# EAGLE design M220loads (EAGLE 6.6.0)
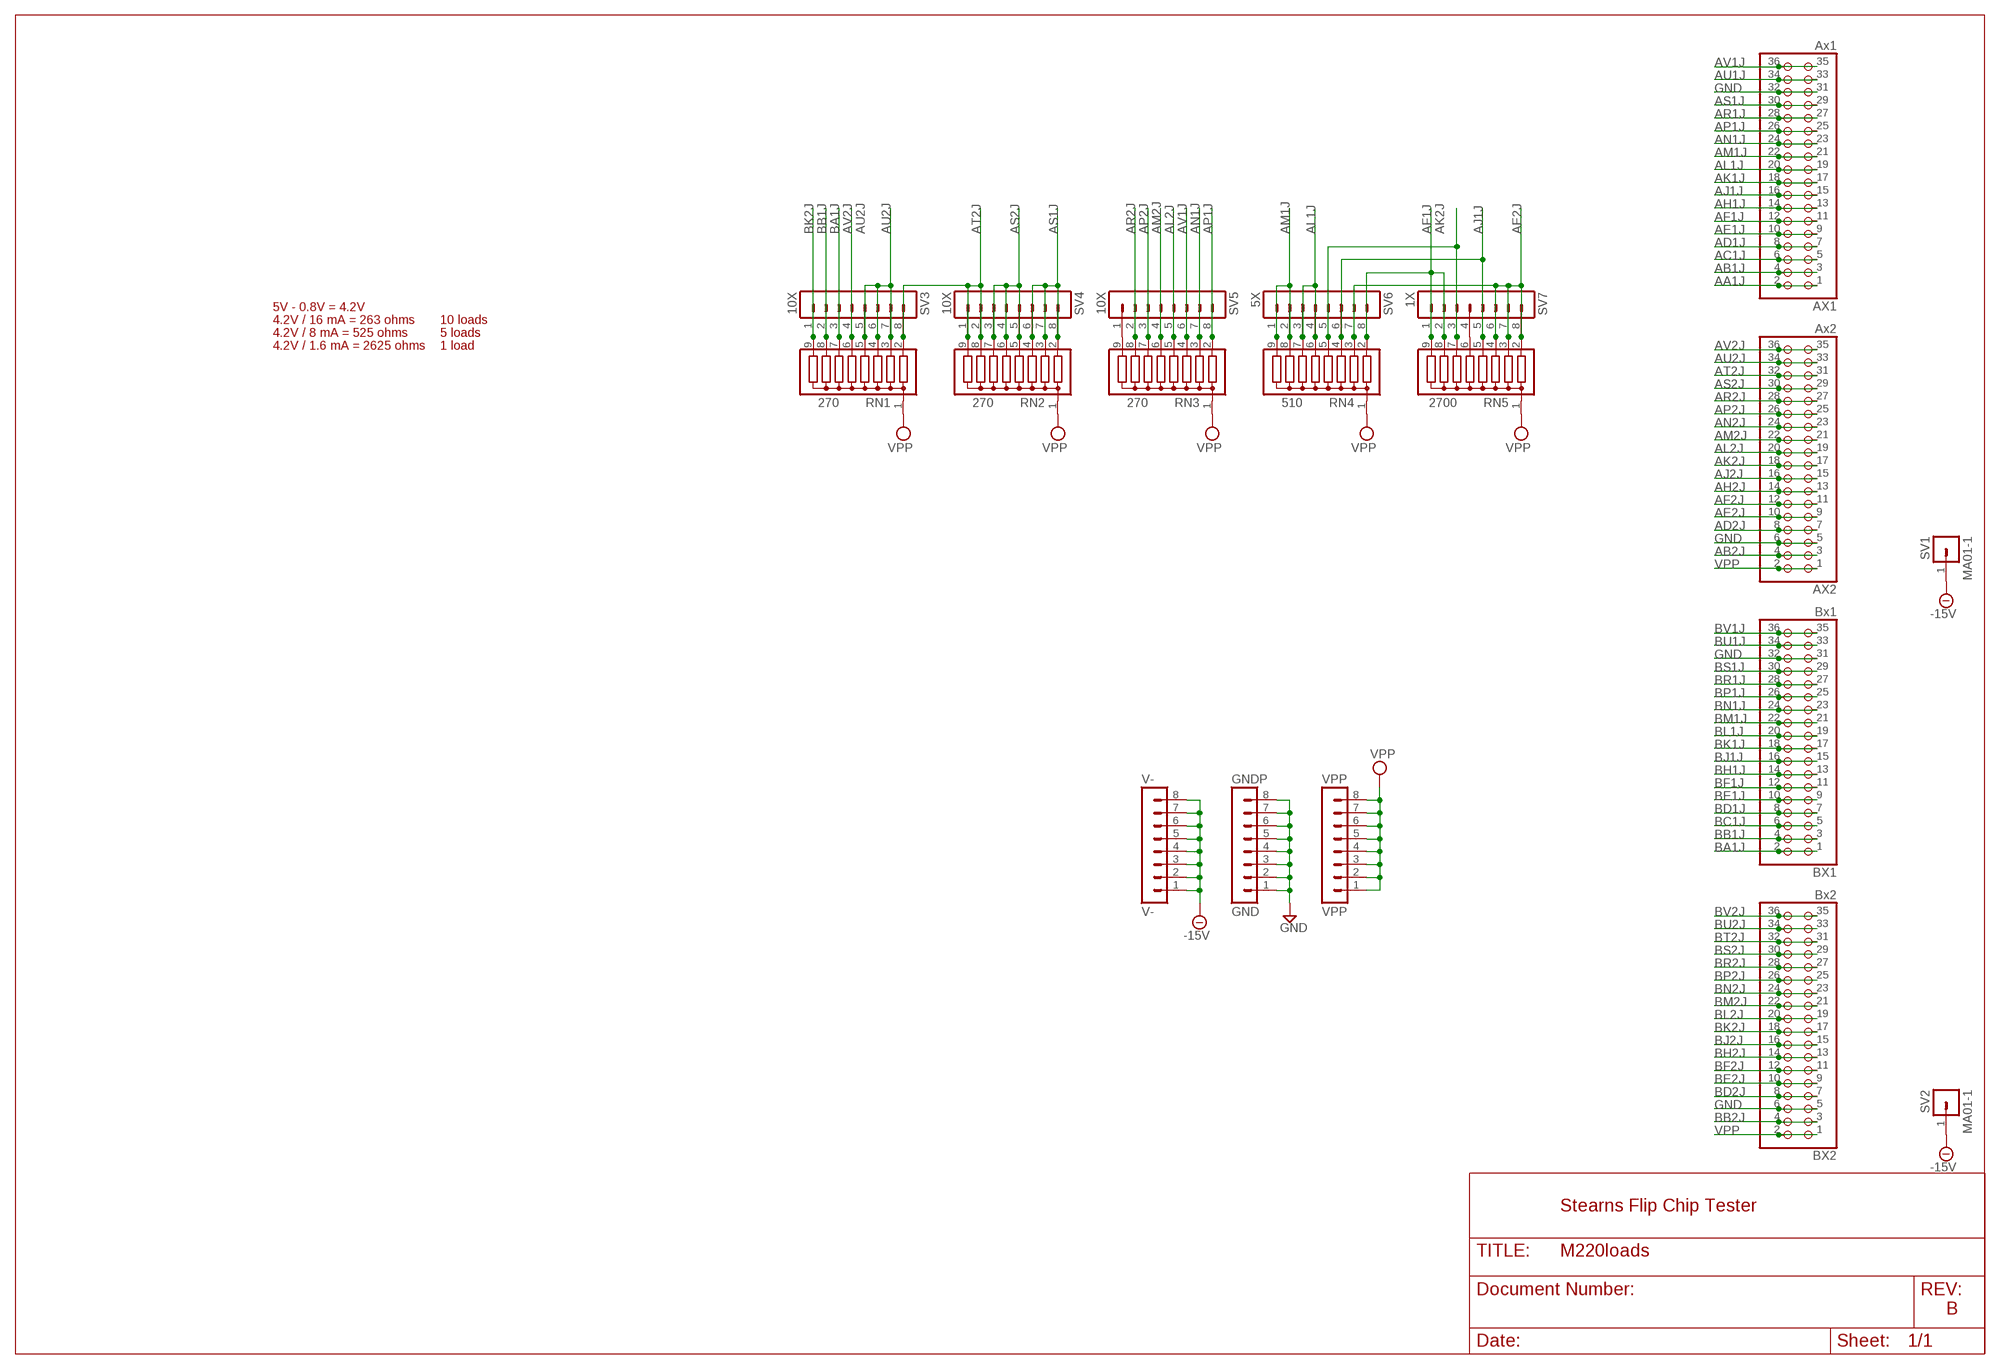
[diagram p0: schematic, sheet 1]

## Parts
AX1  Ax1  PINHD-2X18  [2X18]
AX2  Ax2  PINHD-2X18  [2X18]
BX1  Bx1  PINHD-2X18  [2X18]
BX2  Bx2  PINHD-2X18  [2X18]
GNDP  GND  MA08-1  [MA08-1]
RN1  270  G08R  [SIL9]
RN2  270  G08R  [SIL9]
RN3  270  G08R  [SIL9]
RN4  510  G08R  [SIL9]
RN5  2700  G08R  [SIL9]
SV1  MA01-1  [MA01-1]
SV2  MA01-1  [MA01-1]
SV3  10X  MA08-1  [MA08-1]
SV4  10X  MA08-1  [MA08-1]
SV5  10X  MA08-1  [MA08-1]
SV6  5X  MA08-1  [MA08-1]
SV7  1X  MA08-1  [MA08-1]
V-  V-  MA08-1  [MA08-1]
VPP  VPP  MA08-1  [MA08-1]

## Nets
-15V [Supply]: SV1.1 SV2.1 V-.1 V-.2 V-.3 V-.4 V-.5 V-.6 V-.7 V-.8
AA1J: AX1.1 AX1.2
AB1J: AX1.3 AX1.4
AB2J [Supply]: AX2.3 AX2.4
AC1J: AX1.5 AX1.6
AD1J: AX1.7 AX1.8
AD2J: AX2.7 AX2.8
AE1J: AX1.9 AX1.10
AE2J: AX2.9 AX2.10 RN4.3 RN5.2 RN5.3 RN5.4 SV6.7 SV7.6 SV7.7 SV7.8
AF1J: AX1.11 AX1.12 RN4.2 RN5.8 RN5.9 SV6.8 SV7.1 SV7.2
AF2J: AX2.11 AX2.12
AH1J: AX1.13 AX1.14
AH2J: AX2.13 AX2.14
AJ1J: AX1.15 AX1.16 RN4.4 RN5.5 SV6.6 SV7.5
AJ2J: AX2.15 AX2.16
AK1J: AX1.17 AX1.18
AK2J: AX2.17 AX2.18 RN4.5 RN5.7 SV6.5 SV7.3
AL1J: AX1.19 AX1.20 RN4.6 RN4.7 SV6.3 SV6.4
AL2J: AX2.19 AX2.20 RN3.5 SV5.5
AM1J: AX1.21 AX1.22 RN4.8 RN4.9 SV6.1 SV6.2
AM2J: AX2.21 AX2.22 RN3.6 SV5.4
AN1J: AX1.23 AX1.24 RN3.3 SV5.7
AN2J: AX2.23 AX2.24
AP1J: AX1.25 AX1.26 RN3.2 SV5.8
AP2J: AX2.25 AX2.26 RN3.7 SV5.3
AR1J: AX1.27 AX1.28
AR2J: AX2.27 AX2.28 RN3.8 SV5.2
AS1J: AX1.29 AX1.30 RN2.2 RN2.3 RN2.4 SV4.6 SV4.7 SV4.8
AS2J: AX2.29 AX2.30 RN2.5 RN2.6 RN2.7 SV4.3 SV4.4 SV4.5
AT2J: AX2.31 AX2.32 RN1.2 RN2.8 RN2.9 SV3.8 SV4.1 SV4.2
AU1J: AX1.33 AX1.34
AU2J: AX2.33 AX2.34 RN1.3 RN1.4 RN1.5 SV3.5 SV3.6 SV3.7
AV1J: AX1.35 AX1.36 RN3.4 SV5.6
AV2J: AX2.35 AX2.36 RN1.6 SV3.4
BA1J: BX1.1 BX1.2 RN1.7 SV3.3
BB1J: BX1.3 BX1.4 RN1.8 SV3.2
BB2J: BX2.3 BX2.4
BC1J: BX1.5 BX1.6
BD1J: BX1.7 BX1.8
BD2J: BX2.7 BX2.8
BE1J: BX1.9 BX1.10
BE2J: BX2.9 BX2.10
BF1J: BX1.11 BX1.12
BF2J: BX2.11 BX2.12
BH1J: BX1.13 BX1.14
BH2J: BX2.13 BX2.14
BJ1J: BX1.15 BX1.16
BJ2J: BX2.15 BX2.16
BK1J: BX1.17 BX1.18
BK2J: BX2.17 BX2.18 RN1.9 SV3.1
BL1J: BX1.19 BX1.20
BL2J: BX2.19 BX2.20
BM1J: BX1.21 BX1.22
BM2J: BX2.21 BX2.22
BN1J: BX1.23 BX1.24
BN2J: BX2.23 BX2.24
BP1J: BX1.25 BX1.26
BP2J: BX2.25 BX2.26
BR1J: BX1.27 BX1.28
BR2J: BX2.27 BX2.28
BS1J: BX1.29 BX1.30
BS2J: BX2.29 BX2.30
BT2J: BX2.31 BX2.32
BU1J: BX1.33 BX1.34
BU2J: BX2.33 BX2.34
BV1J: BX1.35 BX1.36
BV2J: BX2.35 BX2.36
GND [Supply]: AX1.31 AX1.32 AX2.5 AX2.6 BX1.31 BX1.32 BX2.5 BX2.6 GNDP.1 GNDP.2 GNDP.3 GNDP.4 GNDP.5 GNDP.6 GNDP.7 GNDP.8
N$1: RN3.9 SV5.1
N$2: RN5.6 SV7.4
VPP [Supply]: AX2.1 AX2.2 BX2.1 BX2.2 RN1.1 RN2.1 RN3.1 RN4.1 RN5.1 VPP.1 VPP.2 VPP.3 VPP.4 VPP.5 VPP.6 VPP.7 VPP.8

## Notes on the sheet
- 5V - 0.8V = 4.2V
- 4.2V / 16 mA = 263 ohms | 10 loads
- 4.2V / 8 mA = 525 ohms | 5 loads
- 4.2V / 1.6 mA = 2625 ohms | 1 load
- Stearns Flip Chip Tester
- B

## Library data of the parts
AX1 AX2 BX1 BX2 = pinhead:PINHD-2X18: PIN HEADER
GNDP SV3-SV7 V- VPP = con-lstb:MA08-1: PIN HEADER; OC_FARNELL: unknown; OC_NEWARK: unknown
RN1-RN5 = resistor-sil:G08R: SIL RESISTOR; OC_FARNELL: unknown; OC_NEWARK: unknown
SV1 SV2 = dec-con:MA01-1: Pin Header (.125" spacing)

## Net classes
1 Supply: width 0.813 mm

## Board
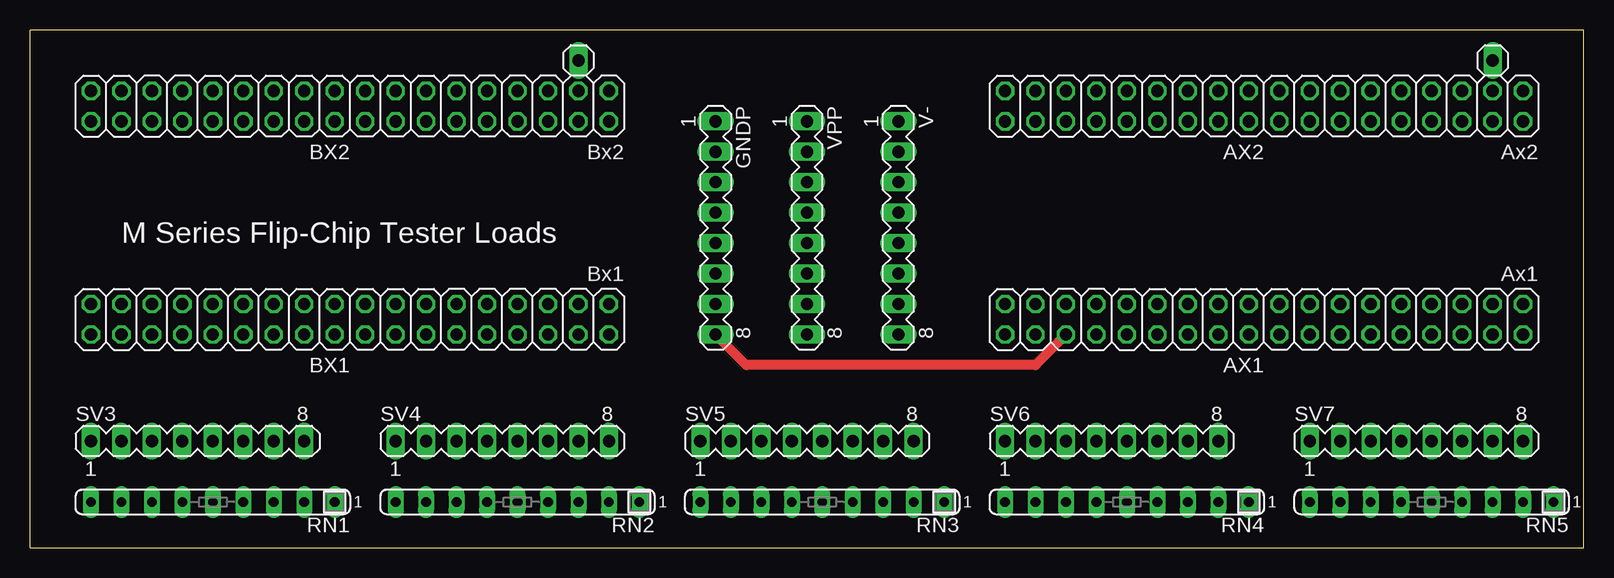
[diagram p1: board, top side]
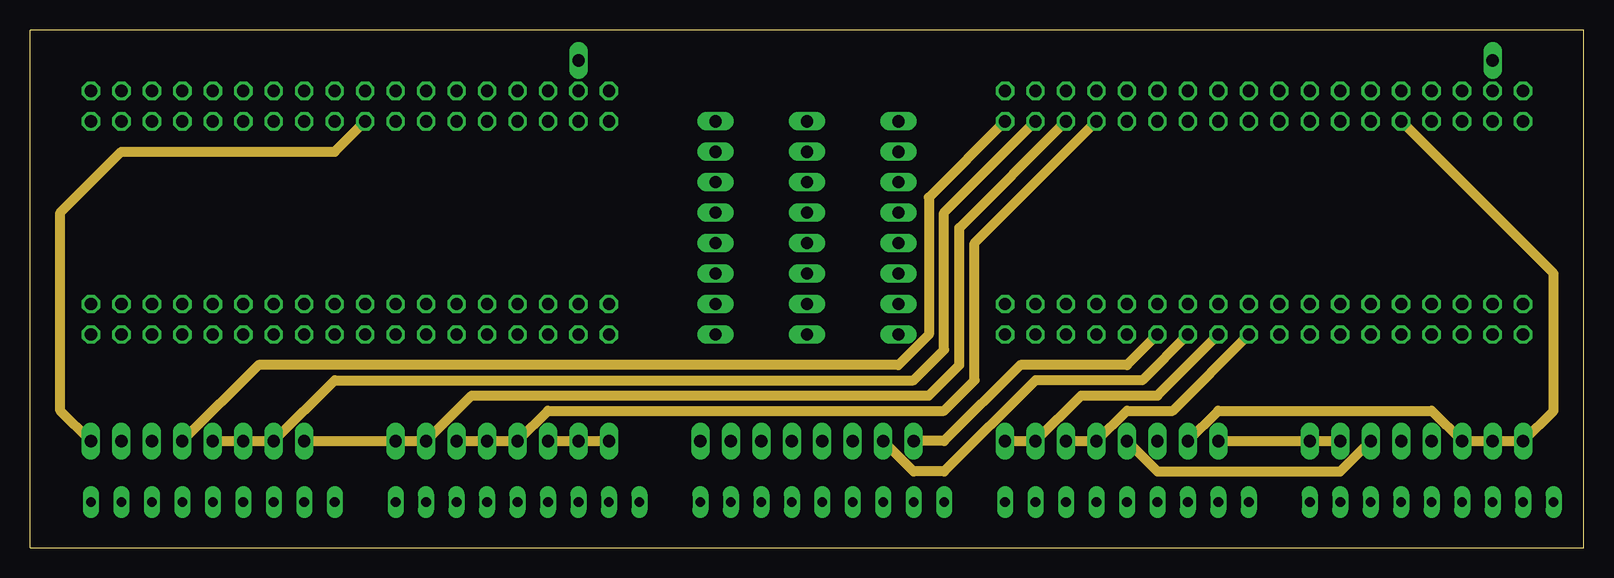
[diagram p2: board, inner layer Route2]
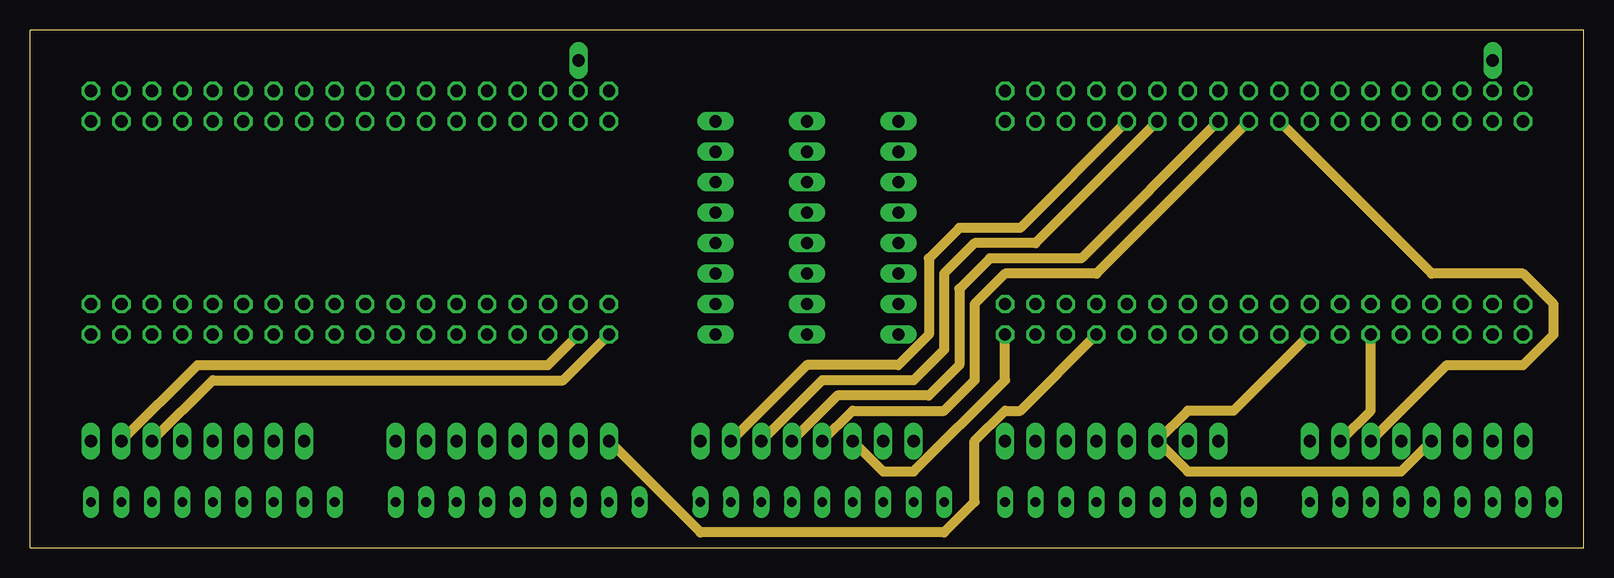
[diagram p3: board, inner layer Route15]
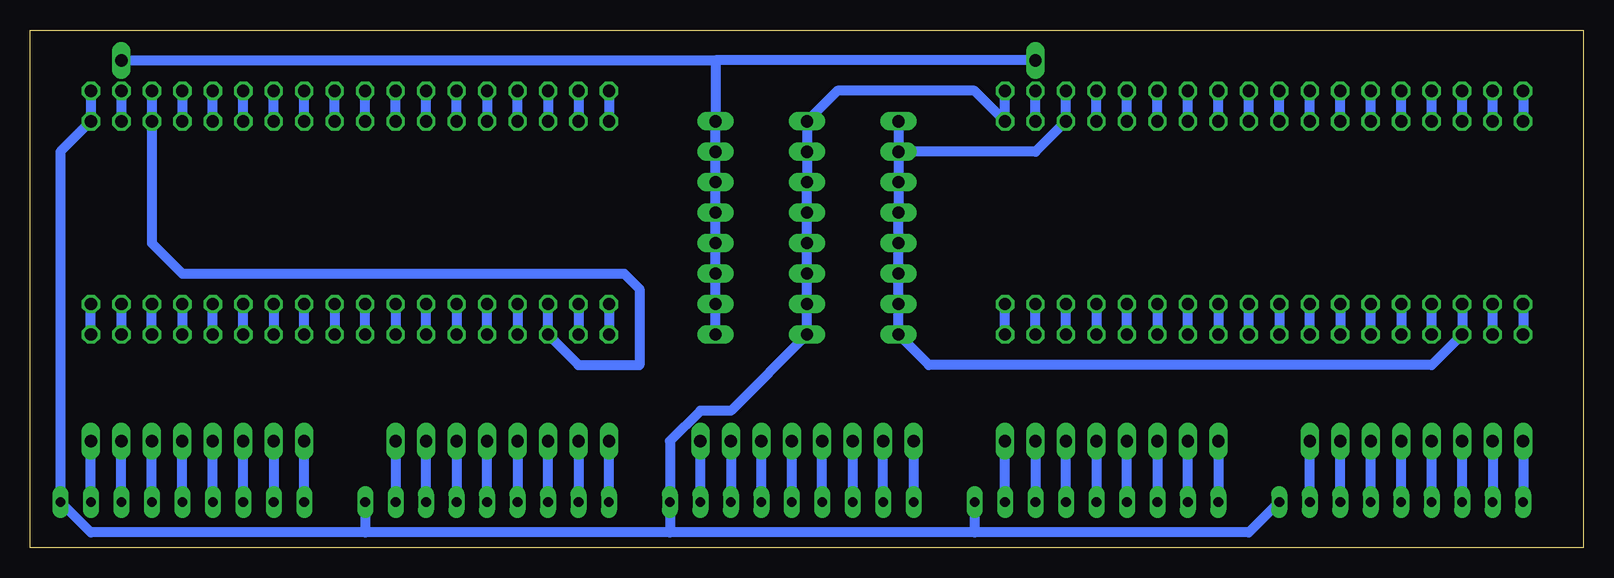
[diagram p4: board, bottom side, seen from below]

Size 129.54 x 43.18 mm. Coordinates in mm from the lower left corner, seen from the top.
Outline: 0,0 129.54,0 129.54,43.18 0,43.18 0,0
Copper layers (1*2*15*16): Top 0.035mm / dielectric 1.5mm / Route2 0.035mm / dielectric 0.15mm / Route15 0.035mm / dielectric 0.2mm / Bottom 0.035mm
Design rules "16mils *": minimum track width 16mil, minimum drill 32mil, track to track 15mil, track to pad 10mil, pad to pad 10mil, via to via 10mil, smd to smd 10mil, copper to edge 13mil, drill to drill 10mil, minimum pad ring 10mil, minimum via ring 8mil, stop-mask expansion 0mil, vias tented up to drill 0mil, thermal gap 10mil
vRestrict: area 7.6,25.4 to 44.5,27.9

### Footprints (pad centres in the part's own frame; a part is rotated, then mirrored left to right if it is on the bottom)
2X18 = drill 1.016 octagon: 1 -21.59,-1.27; 2 -21.59,1.27; 3 -19.05,-1.27; 4 -19.05,1.27; 5 -16.51,-1.27; 6 -16.51,1.27; 7 -13.97,-1.27; 8 -13.97,1.27; 9 -11.43,-1.27; 10 -11.43,1.27; 11 -8.89,-1.27; 12 -8.89,1.27; 13 -6.35,-1.27; 14 -6.35,1.27; 15 -3.81,-1.27; 16 -3.81,1.27; 17 -1.27,-1.27; 18 -1.27,1.27; 19 1.27,-1.27; 20 1.27,1.27; 21 3.81,-1.27; 22 3.81,1.27; 23 6.35,-1.27; 24 6.35,1.27; 25 8.89,-1.27; 26 8.89,1.27; 27 11.43,-1.27; 28 11.43,1.27; 29 13.97,-1.27; 30 13.97,1.27; 31 16.51,-1.27; 32 16.51,1.27; 33 19.05,-1.27; 34 19.05,1.27; 35 21.59,-1.27; 36 21.59,1.27
MA08-1 = drill 1.016 long: 1 -8.89,0; 2 -6.35,0; 3 -3.81,0; 4 -1.27,0; 5 1.27,0; 6 3.81,0; 7 6.35,0; 8 8.89,0
SIL9 = drill 0.813 long: 1 -10.16,0; 2 -7.62,0; 3 -5.08,0; 4 -2.54,0; 5 0,0; 6 2.54,0; 7 5.08,0; 8 7.62,0; 9 10.16,0
MA01-1 = drill 1.016 long: 1 0,0

### Placement (x,y rotation side)
AX1  102.87,19.05 180 top
AX2  102.87,36.83 180 top
BX1  26.67,19.05 180 top
BX2  26.67,36.83 180 top
GNDP  57.15,26.67 270 top
RN1  15.24,3.81 180 top
RN2  40.64,3.81 180 top
RN3  66.04,3.81 180 top
RN4  91.44,3.81 180 top
RN5  116.84,3.81 180 top
SV1  121.92,40.64 0 top
SV2  45.72,40.64 0 top
SV3  13.97,8.89 0 top
SV4  39.37,8.89 0 top
SV5  64.77,8.89 0 top
SV6  90.17,8.89 0 top
SV7  115.57,8.89 0 top
V-  72.39,26.67 270 top
VPP  64.77,26.67 270 top

### Tracks (layer width: path | path; a pad name or v marks a point on that pad's centre or on a via)
-15V
  Bottom 0.813: SV2.1 72.39,40.64 | SV1.1 72.39,40.64 | 72.39,40.64 V-.1 V-.2 V-.3 V-.4 V-.5 V-.6 V-.7 V-.8
AA1J
  Bottom 0.813: AX1.2 AX1.1
AB1J
  Bottom 0.813: AX1.3 AX1.4
AB2J
  Bottom 0.813: AX2.3 AX2.4
AC1J
  Bottom 0.813: AX1.6 AX1.5
AD1J
  Bottom 0.813: AX1.7 AX1.8
AD2J
  Bottom 0.813: AX2.7 AX2.8
AE1J
  Bottom 0.813: AX1.10 AX1.9
AE2J
  Route2 0.813: AX2.10 127,22.86 127,11.43 SV7.8 SV7.7 SV7.6 116.84,11.43 99.06,11.43 SV6.7
  Bottom 0.813: RN5.4 SV7.6 | RN5.3 SV7.7 | RN5.2 SV7.8 | AX2.10 AX2.9 | RN4.3 SV6.7
AF1J
  Route2 0.813: SV7.2 SV7.1 SV6.8
  Route15 0.813: AX1.12 111.76,11.43 SV7.2
  Bottom 0.813: AX1.12 AX1.11 | RN5.9 SV7.1 | SV7.2 RN5.8 | SV6.8 RN4.2
AF2J
  Bottom 0.813: AX2.12 AX2.11
AH1J
  Bottom 0.813: AX1.13 AX1.14
AH2J
  Bottom 0.813: AX2.14 AX2.13
AJ1J
  Route15 0.813: AX1.16 100.33,11.43 96.52,11.43 SV6.6 96.52,6.35 114.3,6.35 SV7.5
  Bottom 0.813: SV6.6 RN4.4 | AX1.16 AX1.15 | RN5.5 SV7.5
AJ2J
  Bottom 0.813: AX2.16 AX2.15
AK1J
  Bottom 0.813: AX1.17 AX1.18
AK2J
  Route2 0.813: SV6.5 93.98,6.35 109.22,6.35 SV7.3
  Route15 0.813: AX2.18 116.84,22.86 124.46,22.86 127,20.32 127,17.78 124.46,15.24 118.11,15.24 SV7.3
  Bottom 0.813: RN4.5 SV6.5 | AX2.18 AX2.17 | RN5.7 SV7.3
AL1J
  Route2 0.813: SV6.3 SV6.4 91.44,11.43 95.25,11.43 AX1.20
  Bottom 0.813: AX1.20 AX1.19 | RN4.7 SV6.3 | SV6.4 RN4.6
AL2J
  Route15 0.813: AX2.20 88.9,22.86 81.28,22.86 78.74,20.32 78.74,13.97 76.2,11.43 68.58,11.43 SV5.5
  Bottom 0.813: AX2.20 AX2.19 | SV5.5 RN3.5
AM1J
  Route2 0.813: SV6.1 SV6.2 87.63,12.7 93.98,12.7 AX1.22
  Bottom 0.813: AX1.21 AX1.22 | RN4.9 SV6.1 | SV6.2 RN4.8
AM2J
  Route15 0.813: AX2.22 87.63,24.13 80.01,24.13 77.47,21.59 77.47,15.24 74.93,12.7 67.31,12.7 SV5.4
  Bottom 0.813: AX2.22 AX2.21 | RN3.6 SV5.4
AN1J
  Route2 0.813: AX1.24 92.71,13.97 83.82,13.97 76.2,6.35 73.66,6.35 SV5.7
  Bottom 0.813: AX1.24 AX1.23 | SV5.7 RN3.3
AN2J
  Bottom 0.813: AX2.24 AX2.23
AP1J
  Route2 0.813: AX1.26 91.44,15.24 82.55,15.24 76.2,8.89 SV5.8
  Bottom 0.813: AX1.25 AX1.26 | RN3.2 SV5.8
AP2J
  Route15 0.813: AX2.26 83.82,25.4 78.74,25.4 76.2,22.86 76.2,16.51 73.66,13.97 66.04,13.97 SV5.3
  Bottom 0.813: AX2.26 AX2.25 | SV5.3 RN3.7
AR1J
  Bottom 0.813: AX1.28 AX1.27
AR2J
  Route15 0.813: AX2.28 82.55,26.67 77.47,26.67 74.93,24.13 74.93,17.78 72.39,15.24 64.77,15.24 SV5.2
  Bottom 0.813: AX2.27 AX2.28 | RN3.8 SV5.2
AS1J
  Route2 0.813: SV4.8 SV4.7 SV4.6
  Route15 0.813: AX1.30 82.55,11.43 81.28,11.43 78.74,8.89 78.74,3.81 76.2,1.27 55.88,1.27 SV4.8
  Bottom 0.813: AX1.29 AX1.30 | SV4.7 RN2.3 | RN2.2 SV4.8 | RN2.4 SV4.6
AS2J
  Route2 0.813: AX2.30 78.74,25.4 78.74,13.97 76.2,11.43 43.18,11.43 SV4.5 SV4.4 SV4.3
  Bottom 0.813: AX2.30 AX2.29 | RN2.6 SV4.4 | SV4.5 RN2.5 | SV4.3 RN2.7
AT2J
  Route2 0.813: AX2.32 77.47,26.67 77.47,15.24 74.93,12.7 36.83,12.7 SV4.2 SV4.1 SV3.8
  Bottom 0.813: AX2.31 AX2.32 | SV4.1 RN2.9 | RN2.8 SV4.2 | RN1.2 SV3.8
AU1J
  Bottom 0.813: AX1.33 AX1.34
AU2J
  Route2 0.813: AX2.34 76.2,27.94 76.2,16.51 73.66,13.97 25.4,13.97 SV3.7 SV3.6 SV3.5
  Bottom 0.813: AX2.33 AX2.34 | RN1.4 SV3.6 | RN1.3 SV3.7 | RN1.5 SV3.5
AV1J
  Route15 0.813: AX1.36 81.28,13.97 73.66,6.35 71.12,6.35 SV5.6
  Bottom 0.813: AX1.35 AX1.36 | RN3.4 SV5.6
AV2J
  Route2 0.813: AX2.36 74.93,29.21 74.93,17.78 72.39,15.24 19.05,15.24 SV3.4
  Bottom 0.813: AX2.35 AX2.36 | RN1.6 SV3.4
BA1J
  Route15 0.813: SV3.3 15.24,13.97 44.45,13.97 BX1.2
  Bottom 0.813: BX1.2 BX1.1 | RN1.7 SV3.3
BB1J
  Route15 0.813: SV3.2 13.97,15.24 43.18,15.24 BX1.4
  Bottom 0.813: BX1.4 BX1.3 | SV3.2 RN1.8
BB2J
  Bottom 0.813: BX2.4 BX2.3
BC1J
  Bottom 0.813: BX1.6 BX1.5
BD1J
  Bottom 0.813: BX1.7 BX1.8
BD2J
  Bottom 0.813: BX2.8 BX2.7
BE1J
  Bottom 0.813: BX1.10 BX1.9
BE2J
  Bottom 0.813: BX2.10 BX2.9
BF1J
  Bottom 0.813: BX1.11 BX1.12
BF2J
  Bottom 0.813: BX2.12 BX2.11
BH1J
  Bottom 0.813: BX1.14 BX1.13
BH2J
  Bottom 0.813: BX2.14 BX2.13
BJ1J
  Bottom 0.813: BX1.15 BX1.16
BJ2J
  Bottom 0.813: BX2.16 BX2.15
BK1J
  Bottom 0.813: BX1.18 BX1.17
BK2J
  Route2 0.813: SV3.1 2.54,11.43 2.54,27.94 7.62,33.02 25.4,33.02 BX2.18
  Bottom 0.813: BX2.18 BX2.17 | SV3.1 RN1.9
BL1J
  Bottom 0.813: BX1.19 BX1.20
BL2J
  Bottom 0.813: BX2.20 BX2.19
BM1J
  Bottom 0.813: BX1.22 BX1.21
BM2J
  Bottom 0.813: BX2.22 BX2.21
BN1J
  Bottom 0.813: BX1.23 BX1.24
BN2J
  Bottom 0.813: BX2.24 BX2.23
BP1J
  Bottom 0.813: BX1.26 BX1.25
BP2J
  Bottom 0.813: BX2.26 BX2.25
BR1J
  Bottom 0.813: BX1.27 BX1.28
BR2J
  Bottom 0.813: BX2.28 BX2.27
BS1J
  Bottom 0.813: BX1.30 BX1.29
BS2J
  Bottom 0.813: BX2.30 BX2.29
BT2J
  Bottom 0.813: BX2.32 BX2.31
BU1J
  Bottom 0.813: BX1.34 BX1.33
BU2J
  Bottom 0.813: BX2.34 BX2.33
BV1J
  Bottom 0.813: BX1.35 BX1.36
BV2J
  Bottom 0.813: BX2.35 BX2.36
GND
  Top 0.813: AX1.32 83.82,15.24 59.69,15.24 GNDP.8
  Bottom 0.813: GNDP.1 GNDP.2 | GNDP.2 GNDP.3 GNDP.4 GNDP.5 GNDP.6 GNDP.7 GNDP.8 54.61,15.24 12.7,15.24 BX1.32 BX1.31 | GNDP.2 45.72,33.02 BX2.6 BX2.5 | AX2.5 AX2.6 119.38,25.4 116.84,22.86 80.01,22.86 78.74,21.59 78.74,15.24 83.82,15.24 AX1.32 AX1.31
N$1
  Bottom 0.813: SV5.1 RN3.9
N$2
  Bottom 0.813: RN5.6 SV7.4
VPP
  Bottom 0.813: RN1.1 27.94,1.27 50.8,1.27 | 50.8,1.27 76.2,1.27 | 76.2,1.27 101.6,1.27 | 101.6,1.27 124.46,1.27 RN5.1 127,33.02 AX2.2 AX2.1 | RN2.1 50.8,1.27 | 76.2,1.27 RN3.1 76.2,8.89 73.66,11.43 71.12,11.43 VPP.8 VPP.7 VPP.6 VPP.5 VPP.4 VPP.3 VPP.2 VPP.1 62.23,38.1 50.8,38.1 BX2.2 BX2.1 | RN4.1 101.6,1.27

### Text on the board
tPlace: M Series Flip-Chip Tester Loads